# EAGLE schematic ledHeart (EAGLE 8.0.0)
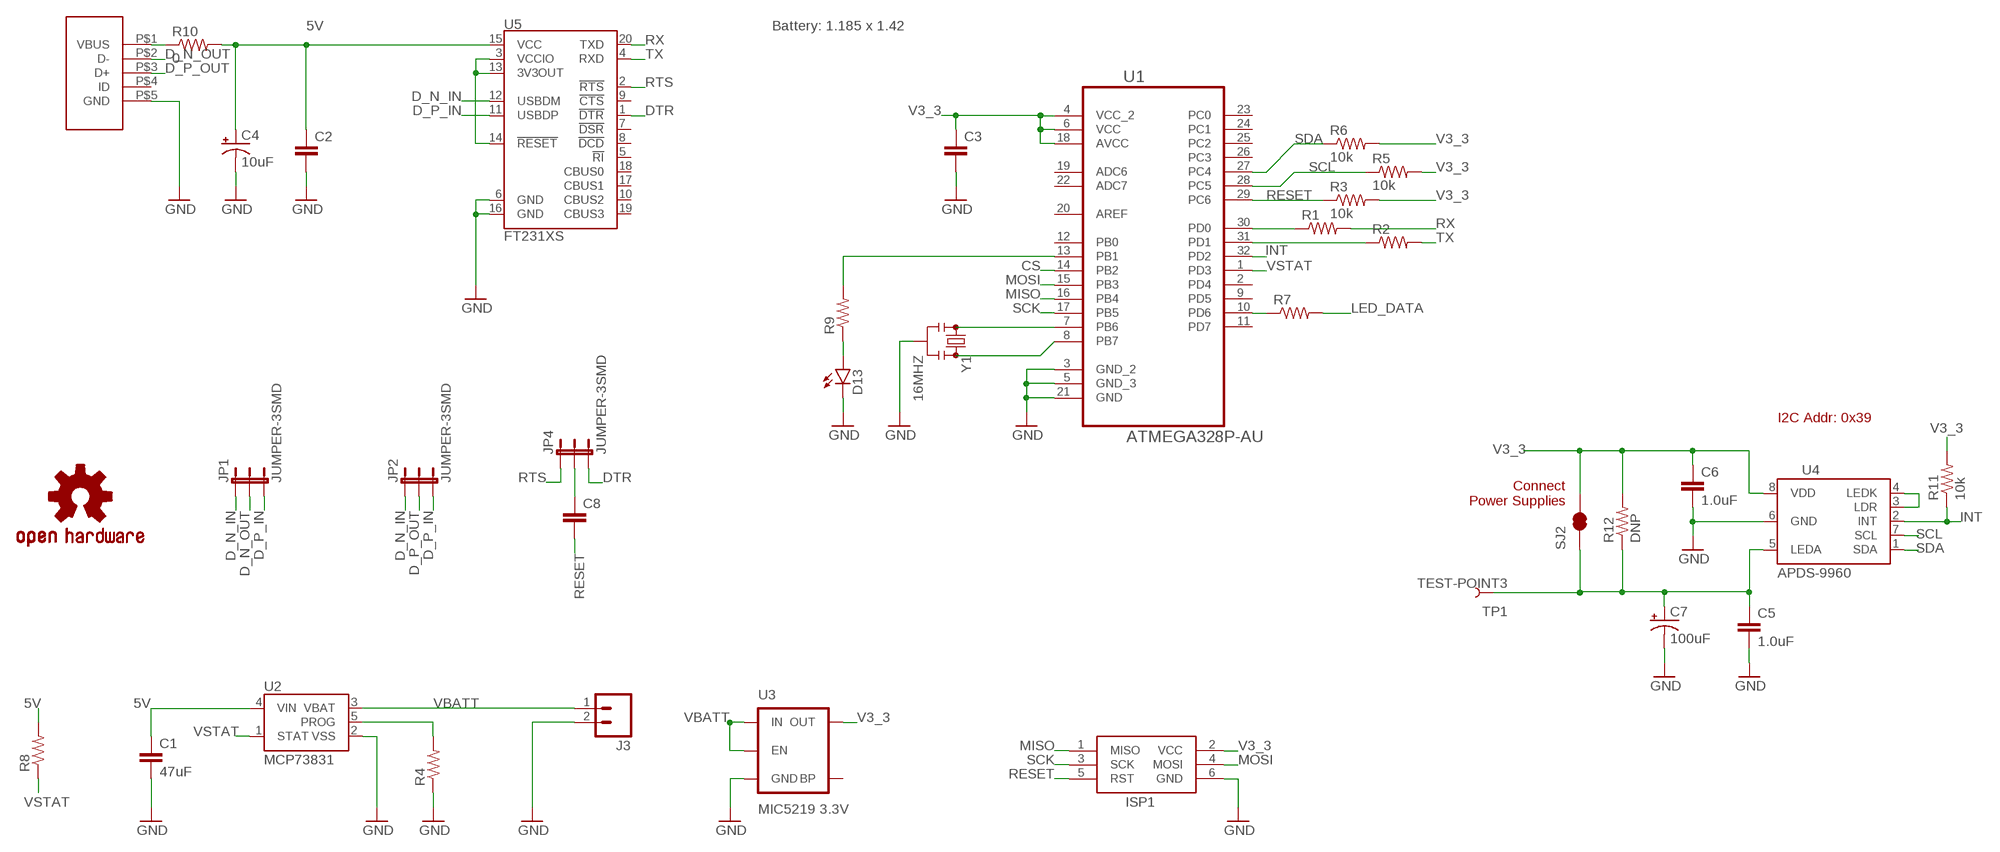
[diagram p0: schematic, sheet 1]

## Parts
C1  47uF  CAP0603-CAP  [0603-CAP@1]
C2  CAP0603-CAP  [0603-CAP@1]
C3  CAP0603-CAP  [0603-CAP@1]
C4  10uF  10UF-6.3V-20%(0603)(TANT)"  [0603-POL]
C5  1.0uF  1.0UF-16V-10%(0603)  [0603-CAP]
C6  1.0uF  1.0UF-16V-10%(0603)  [0603-CAP]
C7  100uF  100UF-10V-10%(TANT)  [EIA7343]
C8  CAP0603-CAP  [0603-CAP@1]
D13  LED0603  [LED-0603]
ISP1  AVRISP-BOX  [AVRISP-BOX]
J3  M02PTH  [1X02]
JP1  JUMPER-3SMD  [SJ_3]
JP2  JUMPER-3SMD  [SJ_3]
JP4  JUMPER-3SMD  [SJ_3]
LOGO1  OSHW-LOGOMINI  [OSHW-LOGO-MINI]
R1  RESISTOR0603-RES  [0603-RES]
R2  RESISTOR0603-RES  [0603-RES]
R3  10k  RESISTOR0603-RES  [0603-RES]
R4  RESISTOR0603-RES  [0603-RES]
R5  10k  RESISTOR0603-RES  [0603-RES]
R6  10k  RESISTOR0603-RES  [0603-RES]
R7  RESISTOR0603-RES  [0603-RES]
R8  RESISTOR0603-RES  [0603-RES]
R9  RESISTOR0603-RES  [0603-RES]
R10  0  RESISTOR0603-RES  [0603-RES]
R11  10k  10KOHM1/10W1%(0603)0603  [0603-RES]
R12  DNP  RESISTOR0603  [0603-RES]
SJ2  SOLDERJUMPERNC  [SJ_2S]
TP1  TEST-POINT3  [PAD.03X.03]
U1  ATMEGA328P-AU  [QFP80P900X900X120-32N]
U2  MCP73831  [SOT23-5]
U3  MIC5219 3.3V  V_REG_MIC52193.3V  [SOT23-5]
U4  APDS-9960  [APDS-9960]
U5  FT231XS  [SSOP20_L]
U$2  TE_USB_A121025CT  [TE_USB_A121025CT]
Y1  16MHZ  RESONATOR16MHZ  [RESONATOR-SMD]

## Nets
5V: C1.1 C2.1 C4.A(+) R8.2 R10.2 U2.4(VIN) U5.15(VCC)
CS: U1.14(PB2)
D_N_IN: JP1.1 JP2.1 U5.12(USBDM)
D_N_OUT: JP1.2 U$2.P$2(D-)
D_P_IN: JP1.3 JP2.3 U5.11(USBDP)
D_P_OUT: JP2.2 U$2.P$3(D+)
DTR: JP4.3 U5.1(!DTR)
GND: C1.2 C2.2 C3.2 C4.K(-) C5.2 C6.2 C7.C(-) D13.C ISP1.6(GND) J3.2 R4.1 U1.3(GND_2) U1.5(GND_3) U1.21(GND) U2.2(VSS) U3.2(GND) U4.6(GND) U5.6(GND) U5.16(GND) U$2.P$5(GND) Y1.2
INT: R11.1 U1.32(PD2) U4.2(INT)
LED_DATA: R7.2
MISO: ISP1.1(MISO) U1.16(PB4)
MOSI: ISP1.4(MOSI) U1.15(PB3)
N$1: R1.1 U1.30(PD0)
N$2: R2.1 U1.31(PD1)
N$3: U4.3(LDR) U4.4(LEDK)
N$4: R10.1 U$2.P$1(VBUS)
N$5: U5.3(VCCIO) U5.13(3V3OUT) U5.14(!RESET)
N$7: U1.8(PB7) Y1.3
N$8: U1.7(PB6) Y1.1
N$9: R4.2 U2.5(PROG)
N$10: R7.1 U1.10(PD6)
N$16: TP1.P$1
N$33: R9.2 U1.13(PB1)
N$34: D13.A R9.1
RESET: C8.2 ISP1.5(RST) R3.1 U1.29(PC6)
RTS: JP4.1 U5.2(!RTS)
RTS_OR_DTR: C8.1 JP4.2
RX: R1.2 U5.20(TXD)
SCK: ISP1.3(SCK) U1.17(PB5)
SCL: R5.1 U1.28(PC5) U4.7(SCL)
SDA: R6.1 U1.27(PC4) U4.1(SDA)
TX: R2.2 U5.4(RXD)
V3_3: C3.1 C6.1 ISP1.2(VCC) R3.2 R5.2 R6.2 R11.2 R12.2 SJ2.2 U1.4(VCC_2) U1.6(VCC) U1.18(AVCC) U3.5(OUT) U4.8(VDD)
VBATT: J3.1 U2.3(VBAT) U3.1(IN) U3.3(EN)
VL: C5.1 C7.A(+) R12.1 SJ2.1 U4.5(LEDA)
VSTAT: R8.1 U1.1(PD3) U2.1(STAT)
Unconnected: U1.2(PD4) U1.9(PD5) U1.11(PD7) U1.12(PB0) U1.19(ADC6) U1.20(AREF) U1.22(ADC7) U1.23(PC0) U1.24(PC1) U1.25(PC2) U1.26(PC3) U3.4(BP) U5.5(!RI) U5.7(!DSR) U5.8(!DCD) U5.9(!CTS) U5.10(CBUS2) U5.17(CBUS1) U5.18(CBUS0) U5.19(CBUS3) U$2.P$4(ID)

## Notes on the sheet
- Battery: 1.185 x 1.42
- I2C Addr: 0x39
- Connect
  Power Supplies

## Library data of the parts
C1-C3 C8 = SparkFun-Capacitors:CAP: Capacitor Standard 0603 ceramic capacitor, and 0.1" leaded capacitor.
C4 = SparkFun-Capacitors:10UF-6.3V-20%(0603)(TANT); PROD_ID: CAP-13210
C5 C6 = SparkFun-Capacitors:1.0UF-16V-10%(0603): CAP-00868; PROD_ID: CAP-00868
C7 = SparkFun-Capacitors:100UF-10V-10%(TANT): CAP-07890; PROD_ID: CAP-07890
D13 = SparkFun-LED:LED: LEDs Standard schematic elements and footprints for 5mm, 3mm, 1206, and 0603 sized LEDs. 5mm - Spark Fun Electronics SKU : COM-00529 (and others)
ISP1 = adafruit:AVRISP: AVR ISP HEADER Standard 6 pin header for AVR programming
J3 = SparkFun-Connectors:M02: Standard 2-pin 0.1" header. Use with - straight break away headers ( PRT-00116) - right angle break away headers (PRT-00553) - swiss pins (PRT-00743) - machine pins (PRT-00117) - female headers (PRT-00115) Molex polarized connector foot print use with: PRT-08233 with associated crimp pins and housings. 2.54_SCREWTERM for use with PRT-10571. 3.5mm Screw Terminal footprints for PRT-08084 5mm Screw Terminal footprints for use with PRT-08432
JP1 JP2 JP4 = SparkFun-Retired:JUMPER-3
LOGO1 = SparkFun-Aesthetics:OSHW-LOGO: Open Source Hardware Logo This logo indicates the piece of hardware it is found on incorporates a OSHW license and/or adheres to the definition of open source hardware found here: http://freedomdefined.org/OSHW
R1-R10 = SparkFun-Passives:RESISTOR: Resistor Basic schematic elements and footprints for 0603, 1206, and PTH resistors.
R11 = SparkFun-Resistors:10KOHM1/10W1%(0603): RES-00824; PROD_ID: RES-00824; VALUE: 10K
R12 = SparkFun-Resistors:RESISTOR: Resistor Basic schematic elements and footprints for 0603, 1206, and PTH resistors.
SJ2 = SparkFun-Retired:SOLDERJUMPER: Solder Jumper Standard SMD solder jumper. Used to automate production. Two varients : Normally Open and Normally Closed are the same, but have different paste layers. NC will have a large amount of paste and should jumper during reflow.
TP1 = SparkFun-Passives:TEST-POINT: Bare copper test points for troubleshooting or ICT
U1 = Atmel_By_element14_Batch_1-00:ATMEGA328P-AU: 8-bit Microcontroller with In-System Programmable Flash; MPN: ATMEGA328P-AU; OC_FARNELL: 1715486; OC_NEWARK: 14R4631; PACKAGE: TQFP-32; SUPPLIER: Atmel
U2 = SparkFun-PowerIC:MCP73831: Miniature single cell, fully integrated Li-Ion, Li-polymer charge management controller http://ww1.microchip.com/downloads/en/DeviceDoc/20001984g.pdf IC-09995; PROD_ID: IC-09995
U3 = SparkFun-PowerIC:V_REG_MIC5219: V_REG MIC5219 Standard 3.3V and 5V 500mA LDO voltage regulator in SOT-23 layout. Micrel part MIC5219. BP (by-pass) pin is used to lower output noise with 470pF cap, may be left open.; PROD_ID: VREG-09872
U4 = SparkFun-Sensors:APDS-9960: Avago APDS-9960 digital proximity, ambient light, RGB, and gesture sensor.; PROD_ID: SEN-12005
U5 = SparkFun-DigitalIC:FT231X: FTDI FT231X Full Speed USB to Full-handshake UART This USB2.0 Full Speed IC offers a compact bridge to full handshake UART interfaces. The device is a UART, capable of operating up to 3MBaud, with low power consumption (8mA). The FT231X includes the complete FT-X series feature set and enables USB to be added into a system design quickly and easily over a UART interface.; PROD_ID: IC-11524
U$2 = LEDRingLib:TE_USB_A121025CT: TE USB Micro USB IP68 Digikey <http://www.digikey.com/en/ptm/t/te-connectivity/te-connectivity-amp/ip68-micro-usb?pn_sku=A121025CT-ND&part_id=5215144&video_source=Part_Detail>
Y1 = SparkFun-FreqCtrl:RESONATOR: Resonator Small SMD resonator. Used, eg, on the Arduino Pro/ Pro Mini boards. 8MHz- XTAL-08895 16MHz- XTAL-08900; PROD_ID: XTAL-08900